# Altium schematic sheet Mainboard_V1.0_Sensors.SchDoc: Mainboard
size A4; PageSetup: Record=PageOptions|CenterHorizontal=True|CenterVertical=True|PrintScale=0.97|XCorrection=1.00|YCorrection=1.00|PrintKind=0|BorderSize=5000000|LeftOffset=0|BottomOffset=0|Orientation=2|PaperLength=1000|PaperWidth=1000|Scale=100|PaperSource=7|PrintQuality=-3|MediaType=1|DitherType=10|PrintScaleMode=1|PaperKind=A4|PaperIndex=9; Organization: Ostschweizer Fachhochschule; Address2: Florian Baumgartner & Thierry Schwaller; Address3: florian.baumgartner@ost.ch; DocumentNumber: 7; Revision: V1.0; SheetNumber: 7; SheetTotal: 7; Author: Florian Baumgartner & Alain Keller; Subtitle: Sensors
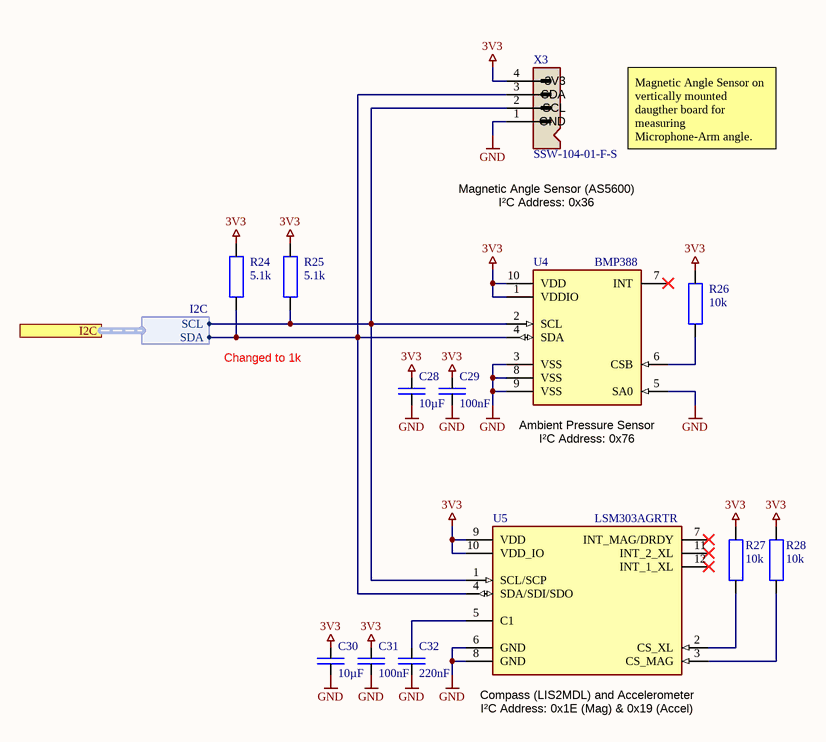
[diagram p0: Mainboard_V1.0_Sensors.SchDoc]

## Parts
C28  10µF  [SMD Keramikkondensator 1206]
C29  100nF  [SMD Keramikkondensator 0603]
C30  10µF  [SMD Keramikkondensator 1206]
C31  100nF  [SMD Keramikkondensator 0603]
C32  220nF  [SMD Keramikkondensator 0603]
R24  5.1k  [SMD Widerstand 0603]
R25  5.1k  [SMD Widerstand 0603]
R26  10k  [SMD Widerstand 0603]
R27  10k  [SMD Widerstand 0603]
R28  10k  [SMD Widerstand 0603]
U4  BMP388  [SMD IC LGA-10]
U5  LSM303AGRTR  [SMD IC LGA-12]
X3  SSW-104-01-F-S  [THT Buchsenleiste 4-Pol (1x4)]

## Ports
I2C (harness I2C)

## Harnesses
I2C: SCL, SDA

## Nets
3V3: C28.2 C29.2 C30.2 C31.2 R24.1 R25.1 R26.2 R27.2 R28.2 U4.1(VDDIO) U4.10(VDD) U5.9(VDD) U5.10(VDD_IO) X3.4
GND: C28.1 C29.1 C30.1 C31.1 C32.1 U4.3(VSS) U4.5(SA0) U4.8(VSS) U4.9(VSS) U5.6(GND) U5.8(GND) X3.1
NetC32_2: C32.2 U5.5(C1)
NetR24_2: R24.2 U4.4(SDA) U5.4(SDA/SDI/SDO) X3.3 ; port I2C.SDA
NetR25_2: R25.2 U4.2(SCL) U5.1(SCL/SCP) X3.2 ; port I2C.SCL
NetR26_1: R26.1 U4.6(CSB)
NetR27_1: R27.1 U5.2(CS_XL)
NetR28_1: R28.1 U5.3(CS_MAG)

Not connected (* = marked no-connect by the designer): U4 7(INT)*; U5 7(INT_MAG/DRDY)* 11(INT_2_XL)* 12(INT_1_XL)*

## Notes on the sheet
- (near X3) 3V3
- (near X3) SDA
- (near X3) SCL
- (near X3) GND
- Magnetic Angle Sensor on vertically mounted daugther board for measuring Microphone-Arm angle.
- Magnetic Angle Sensor (AS5600)
- I²C Address: 0x36
- Changed to 1k
- (near U4) I²C Address: 0x76
- (near U4) Ambient Pressure Sensor
- (near U5) I²C Address: 0x1E (Mag) & 0x19 (Accel)
- (near U5) Compass (LIS2MDL) and Accelerometer
- Title
- Author:
- Subtitle
- Date:
- Rev:
- File:
- Sheet
- of

## Library data of the parts
C28 C30 = E6 - 10uF: SMD Ceramic Capacitor E6; Component Value: 10µF 50V; Component Description: Multilayer Ceramic Capacitors MLCC; ComponentLink1Description: Datasheet; ComponentLink1URL: https://datasheet.lcsc.com/lcsc/1810191219_Samsung-Electro-Mechanics-CL10A106KP8NNNC_C19702.pdf; Digikey: 587-3258-1-ND; Farnell: 2113070; JLC-Parts: C13585; Mouser: 963-LMK107BBJ106MALT; Unit Price: 0.01
C29 C31 = E6 - 100nF: SMD Ceramic Capacitor E6; Component Value: 100nF 50V; Component Description: Multilayer Ceramic Capacitors; ComponentLink1Description: Datasheet; ComponentLink1URL: https://datasheet.lcsc.com/lcsc/1809301912_YAGEO-CC0603KRX7R9BB104_C14663.pdf; Digikey: 445-5666-1-ND; Farnell: 2522432; JLC-Parts: C14663; Mouser: 77-VJ0603V104ZXAPBC; Unit Price: 0.01
C32 = E6 - 100nF: SMD Ceramic Capacitor E6; Component Value: 220nF 50V; Component Description: Multilayer Ceramic Capacitors MLCC; ComponentLink1Description: Datasheet; ComponentLink1URL: https://datasheet.lcsc.com/lcsc/1809301912_YAGEO-CC0603KRX7R9BB104_C14663.pdf; Digikey: 445-173612-1-ND; Farnell: 3416121; JLC-Parts: C21120; Mouser: 810-C1608X7R1H224KAE; Unit Price: 0.01
R24 R25 = R-RESISTOR: RES (E=Heizwiderstand B=Messwandler); Component Description: Thick Film Chip Resistor; Component Value: 5.1k (75V, 100mW, 1%); Digikey: P5.10KHCT-ND; Farnell: 2059378; Mouser: 667-ERJ-3EKF5101V; JLC-Parts: C23186; Unit Price: 0.01
R26-R28 = R-RESISTOR: RES (E=Heizwiderstand B=Messwandler); Component Description: Thick Film Chip Resistor; Component Value: 10k (75V, 100mW, 1%); Digikey: P10.0KHCT-ND; Farnell: 2303192; Mouser: 667-ERJ-3EKF1002V; JLC-Parts: C25804; Unit Price: 0.01
U4 = U-BMP388: Digital Pressure Sensor; ComponentLink1Description: Datasheet; ComponentLink1URL: https://www.bosch-sensortec.com/media/boschsensortec/downloads/datasheets/bst-bmp388-ds001.pdf; Digikey: 828-1079-1-ND; Component Value: BMP388; JLC-Parts: C779278; Mouser: 262-BMP388; Unit Price: 2.40; Component Description: Digital Pressure Sensor
U5 = U-LSM303AGRTR: High-Performance eCompass Module; ComponentLink1Description: Datasheet; ComponentLink1URL: https://www.st.com/content/ccc/resource/technical/document/datasheet/74/c4/19/54/62/c5/46/13/DM00177685.pdf/files/DM00177685.pdf/jcr:content/translations/en.DM00177685.pdf; Digikey: 497-16527-1-ND; Component Value: LSM303AGRTR; Farnell: 2664523; JLC-Parts: C126671; Mouser: 511-LSM303AGRTR; Unit Price: 1.42; Component Description: High-Performance eCompass Module
X3 = X-Stiftleiste (4-Fach): Component Description: Female Pin Header; Digikey: SAM10018-ND; Farnell: 3550891; Mouser: 200-SSW10401FS; Component Value: SSW-104-01-F-S; JLC-Parts: C5116530; Unit Price: 0.07; ComponentLink1Description: Datasheet; ComponentLink1URL: https://datasheet.lcsc.com/lcsc/2207291800_ZHOURI-PM2-54-1-4_C5116530.pdf